# EAGLE schematic ION-KB Bluetooth LiPo (EAGLE 6.5.0)
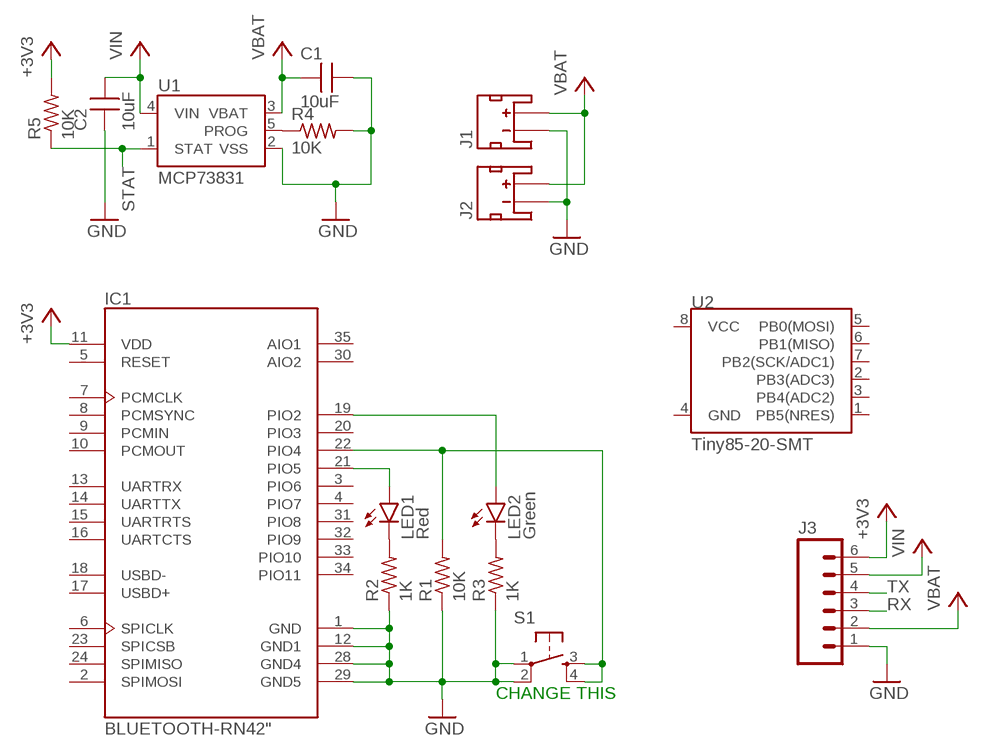
[diagram p0: schematic, sheet 1]

## Parts
C1  10uF  CAPACITOR0603  [C0603]
C2  10uF  CAPACITOR0603  [C0603]
IC1  BLUETOOTH-RN42"  [RN42]
J1  JST_2MM_MALE  [JST-2-SMD]
J2  JST_2MM_MALE  [JST-2-SMD]
J3  1X06M-0.05-PTH  [M-1X06-0.05-PTH]
LED1  Red  LED0603  [L0603]
LED2  Green  LED0603  [L0603]
R1  10K  RESISTOR0603  [R0603]
R2  1K  RESISTOR0603  [R0603]
R3  1K  RESISTOR0603  [R0603]
R4  10K  RESISTOR0603  [R0603]
R5  10K  RESISTOR0603  [R0603]
S1  SWITCH-TACTILESMD  [SWITCH-TACTILE-SMD]
U1  MCP73831  [SOT23-5]
U2  Tiny85-20-SMT  ATTINY45TINY85-20-SMT  [SO08-EIAJ]

## Nets
+3V3: IC1.11(VDD) J3.6 R5.2
GND: C1.2 C2.1 IC1.1(GND) IC1.12(GND1) IC1.28(GND4) IC1.29(GND5) J1.1(-) J2.1(-) J3.1 R1.1 R2.1 R3.1 R4.2 S1.1 S1.2 U1.2(VSS)
N$1: IC1.22(PIO4) R1.2 S1.3 S1.4
N$2: LED1.C R2.2
N$3: IC1.21(PIO5) LED1.A
N$4: IC1.19(PIO2) LED2.A
N$5: LED2.C R3.2
N$6: R4.1 U1.5(PROG)
RX: J3.3
STAT: R5.1 U1.1(STAT)
TX: J3.4
VBAT: C1.1 J1.2(+) J2.2(+) J3.2 U1.3(VBAT)
VIN: C2.2 J3.5 U1.4(VIN)
Unconnected: IC1.2(SPIMOSI) IC1.3(PIO6) IC1.4(PIO7) IC1.5(RESET) IC1.6(SPICLK) IC1.7(PCMCLK) IC1.8(PCMSYNC) IC1.9(PCMIN) IC1.10(PCMOUT) IC1.13(UARTRX) IC1.14(UARTTX) IC1.15(UARTRTS) IC1.16(UARTCTS) IC1.17(USBD+) IC1.18(USBD-) IC1.20(PIO3) IC1.23(SPICSB) IC1.24(SPIMISO) IC1.30(AIO2) IC1.31(PIO8) IC1.32(PIO9) IC1.33(PIO10) IC1.34(PIO11) IC1.35(AIO1) J1.NC1(PAD1) J1.NC2(PAD2) J2.NC1(PAD1) J2.NC2(PAD2) U2.1(PB5(NRES)) U2.2(PB3(ADC3)) U2.3(PB4(ADC2)) U2.4(GND) U2.5(PB0(MOSI)) U2.6(PB1(MISO)) U2.7(PB2(SCK/ADC1)) U2.8(VCC)

## Notes on the sheet
- CHANGE THIS

## Library data of the parts
C1 C2 = Jordi:CAPACITOR
IC1 = Jordi:BLUETOOTH-RN42: Bluetooth SMD module
J1 J2 = SparkFun-Connectors:JST_2MM_MALE: Mates to single-cell LiPo batteries. CONN-11443 Now with smashable polarity marks!; BTM_NEG: -; BTM_POS: +; PROD_ID: CONN-11443; TOP_NEG: -; TOP_POS: +
J3 = Jordi:1X06
LED1 LED2 = Jordi:LED
R1-R5 = Jordi:RESISTOR
S1 = Jordi:SWITCH-TACTILE
U1 = SparkFun-PowerIC:MCP73831: Miniature single cell, fully integrated Li-Ion, Li-polymer charge management controller http://ww1.microchip.com/downloads/en/DeviceDoc/20001984g.pdf IC-09995; PROD_ID: IC-09995
U2 = SparkFun-DigitalIC:ATTINY45: Atmel 8-pin 2/4/8kB flash uC; PROD_ID: IC-09092